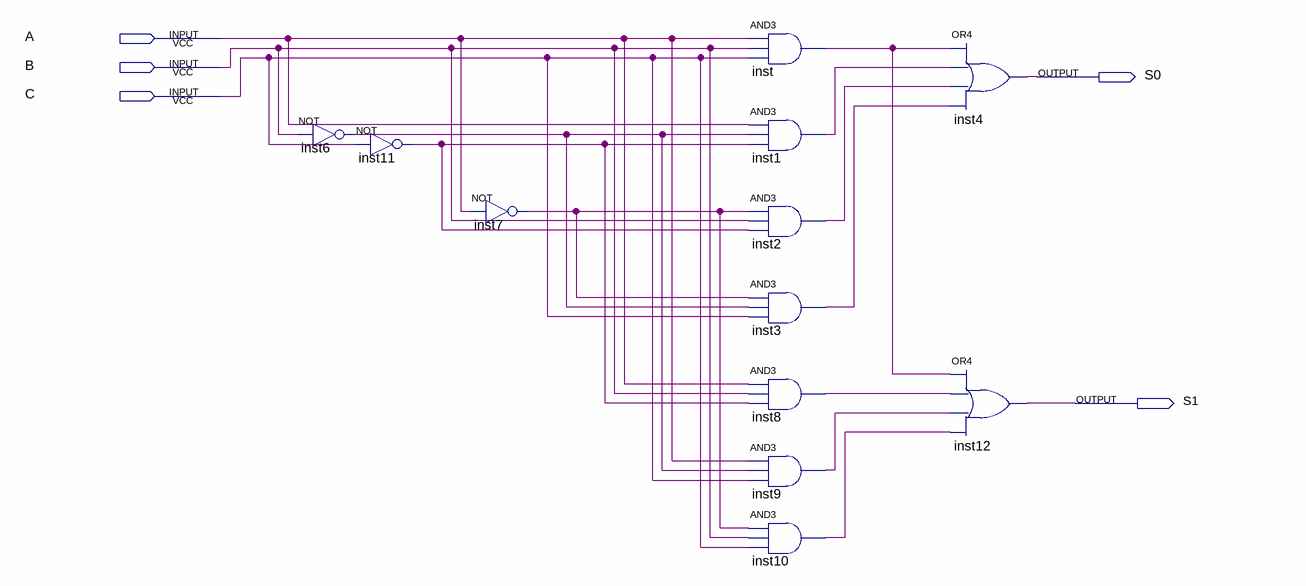
[diagram p0: schematic sheet]
// Quartus schematic Tarea01_logicgates.bdf as structural Verilog: 12 symbols, 5 pins
module Tarea01_logicgates (
  input  A,
  input  B,
  input  C,
  output S0,
  output S1
);

  wire inst1_out, inst2_out, inst3_out, inst6_out, inst7_out, inst8_out, inst9_out, inst10_out, inst11_out,
       inst_out;

  not inst6 (inst6_out, B);
  not inst11 (inst11_out, C);
  not inst7 (inst7_out, A);
  and inst (inst_out, A, B, C);
  and inst1 (inst1_out, A, inst6_out, inst11_out);
  and inst2 (inst2_out, inst7_out, B, inst11_out);
  and inst3 (inst3_out, inst7_out, inst6_out, C);
  and inst8 (inst8_out, A, B, inst11_out);
  and inst9 (inst9_out, A, inst6_out, C);
  and inst10 (inst10_out, inst7_out, B, C);
  or inst4 (S0, inst_out, inst1_out, inst2_out, inst3_out);
  or inst12 (S1, inst_out, inst8_out, inst9_out, inst10_out);
endmodule
